# Altium project 2022_AESK_UAV.PrjPcb
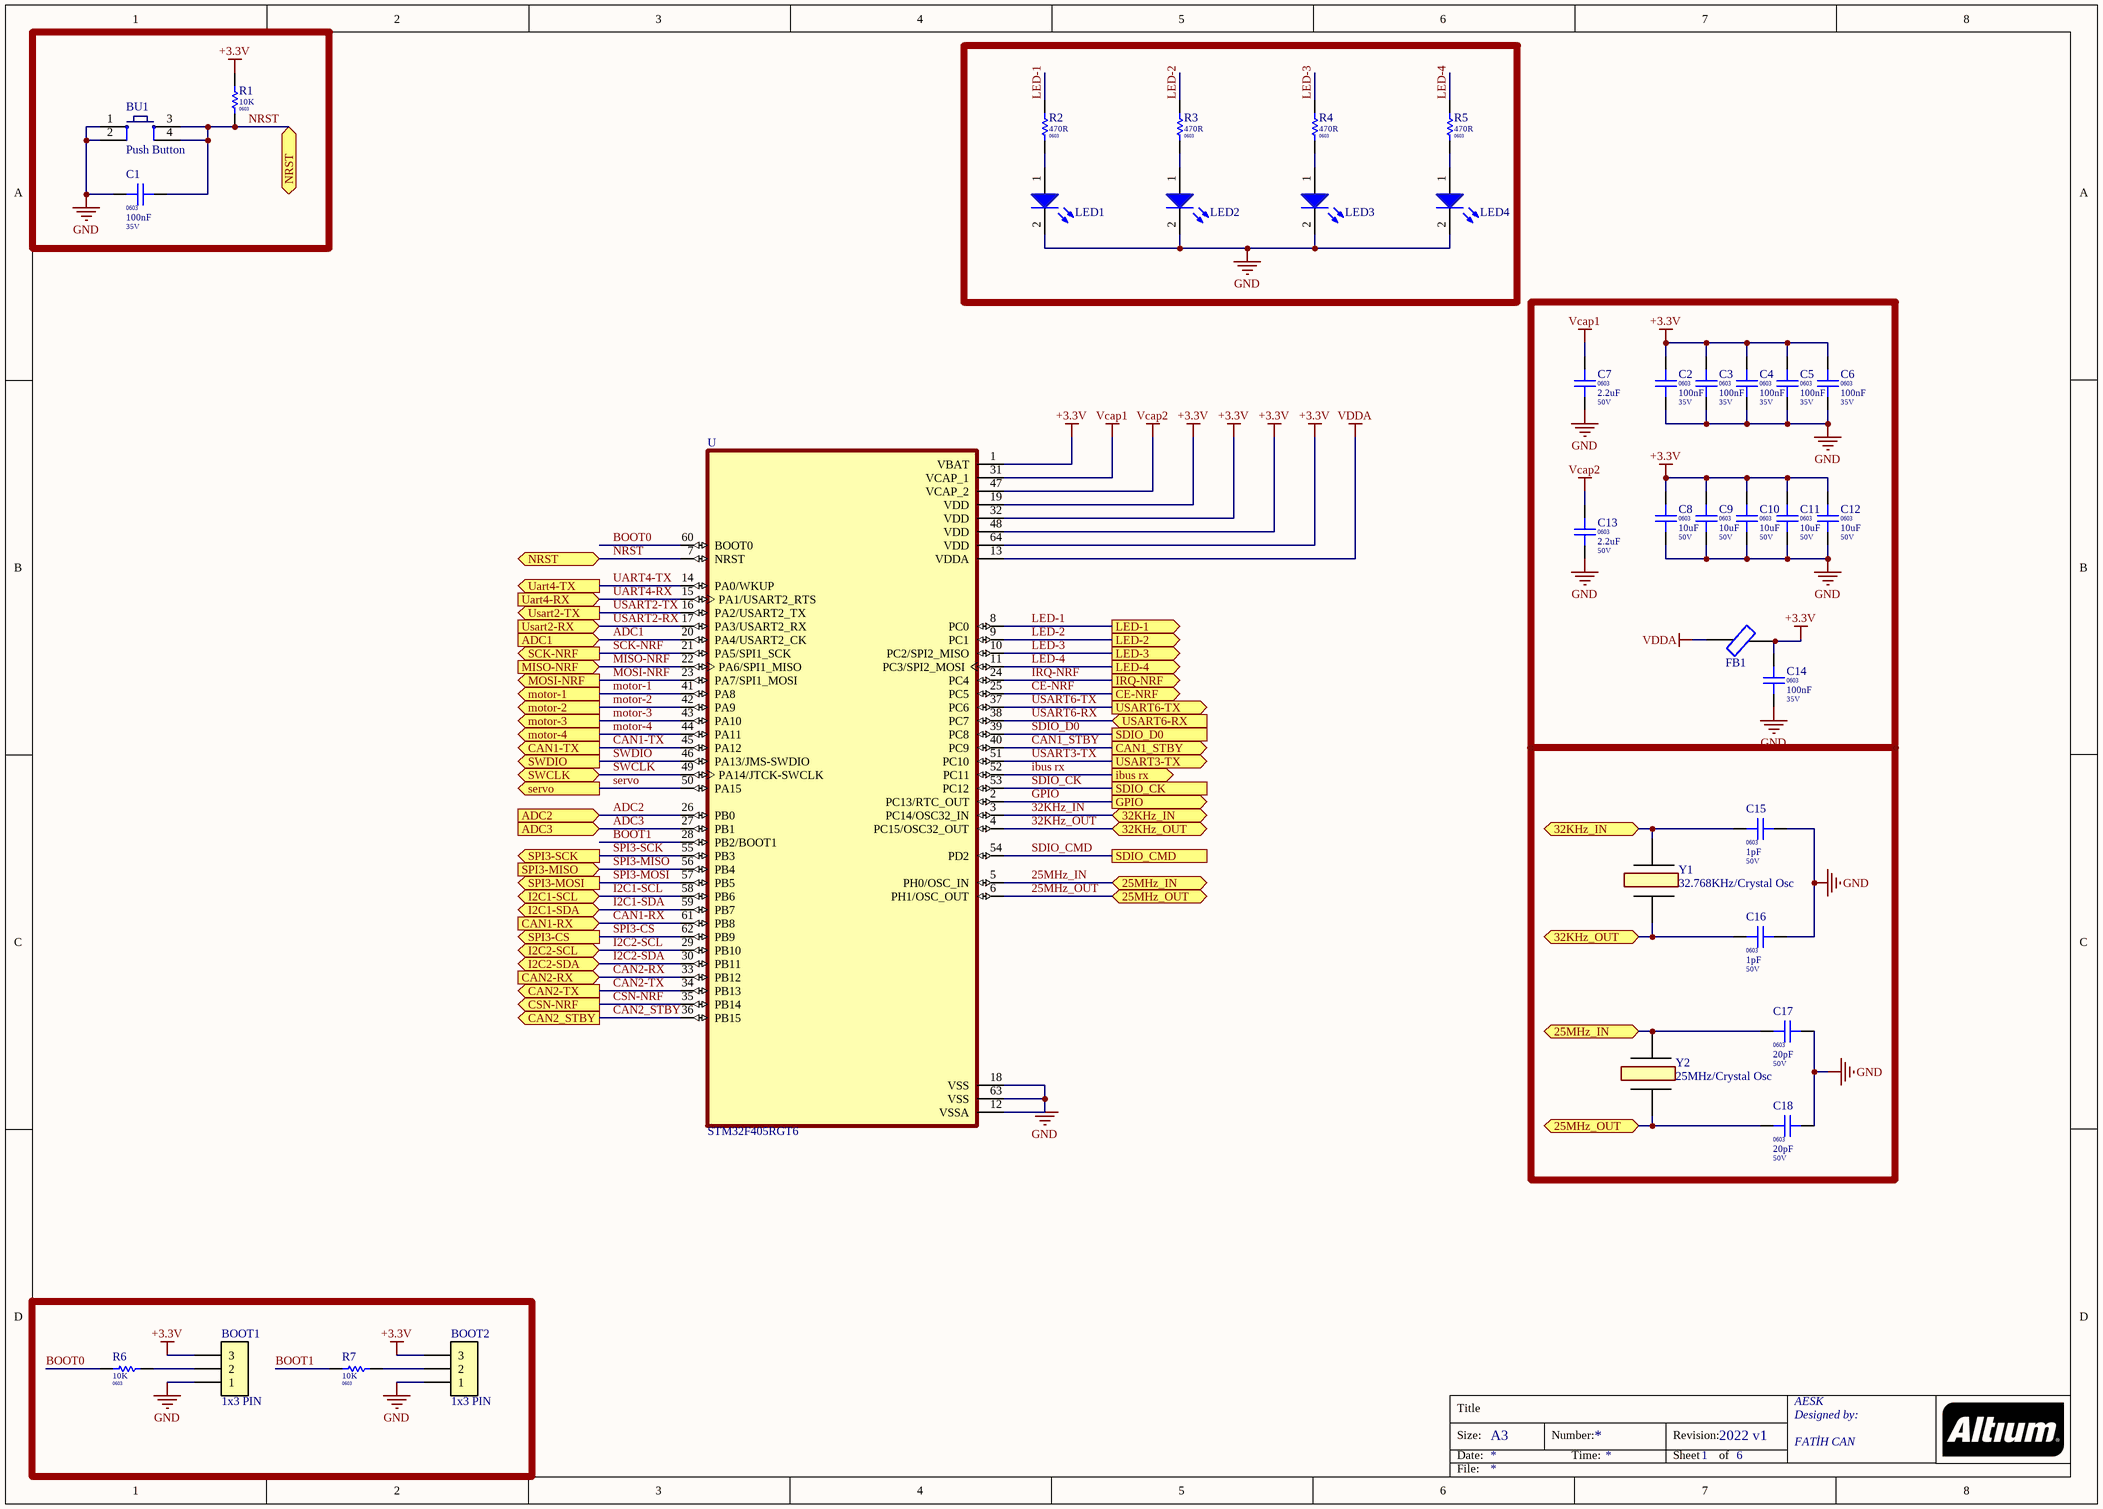
[diagram p0: 2022_AESK_UAV_Islemci.SchDoc]
6 sheets, 95 parts. Net scope: flat (ports and power ports of the same name join across sheets).
Board file: 2022_AESK_UAV.PcbDoc
Sheets:
  2022_AESK_UAV_Islemci.SchDoc
  2022_AESK_UAV_Sensors.SchDoc
  2022_AESK_UAV_Power.SchDoc
  2022_AESK_UAV_EXT_CONN.SchDoc
  2022_AESK_UAV_CAN.SchDoc
  2022_AESK_UAV_CONNECTOR.SchDoc

## Sheet 2022_AESK_UAV_Islemci.SchDoc: =ProjectName
size A3; Organization: AESK; Address1: Designed by:; Address3: FATİH CAN; Revision: 2022 v1; SheetNumber: 1; SheetTotal: 6

### Parts
BOOT1  1x3 PIN  [HDR_2.54_1X3]
BOOT2  1x3 PIN  [HDR_2.54_1X3]
BU1  Push Button  [button son]
C1  Package / Case: 0603  Voltage: 35V  [CAPC 0603]  (hidden comment: 100nF)
C2  Package / Case: 0603  Voltage: 35V  [CAPC 0603]  (hidden comment: 100nF)
C3  Package / Case: 0603  Voltage: 35V  [CAPC 0603]  (hidden comment: 100nF)
C4  Package / Case: 0603  Voltage: 35V  [CAPC 0603]  (hidden comment: 100nF)
C5  Package / Case: 0603  Voltage: 35V  [CAPC 0603]  (hidden comment: 100nF)
C6  Package / Case: 0603  Voltage: 35V  [CAPC 0603]  (hidden comment: 100nF)
C7  Package / Case: 0603  Voltage: 50V  [CAPC 0603]  (hidden comment: 2.2uF)
C8  Package / Case: 0603  Voltage: 50V  [CAPC 0603]  (hidden comment: 10uF)
C9  Package / Case: 0603  Voltage: 50V  [CAPC 0603]  (hidden comment: 10uF)
C10  Package / Case: 0603  Voltage: 50V  [CAPC 0603]  (hidden comment: 10uF)
C11  Package / Case: 0603  Voltage: 50V  [CAPC 0603]  (hidden comment: 10uF)
C12  Package / Case: 0603  Voltage: 50V  [CAPC 0603]  (hidden comment: 10uF)
C13  Package / Case: 0603  Voltage: 50V  [CAPC 0603]  (hidden comment: 2.2uF)
C14  Package / Case: 0603  Voltage: 35V  [CAPC 0603]  (hidden comment: 100nF)
C15  Package / Case: 0603  Voltage: 50V  [CAPC 0603]  (hidden comment: 1pF)
C16  Package / Case: 0603  Voltage: 50V  [CAPC 0603]  (hidden comment: 1pF)
C17  Package / Case: 0603  Voltage: 50V  [CAPC 0603]  (hidden comment: 20pF)
C18  Package / Case: 0603  Voltage: 50V  [CAPC 0603]  (hidden comment: 20pF)
FB1  Ferrite Bead  [FCM1608KF-601T03]  (value not drawn)
LED1  (no value)  [LED BLUE 0603]
LED2  (no value)  [LED BLUE 0603]
LED3  (no value)  [LED BLUE 0603]
LED4  (no value)  [LED BLUE 0603]
R1  Package / Case: 0603  [RESC 0603]  (hidden comment: 10K)
R2  Package / Case: 0603  [RESC 0603]  (hidden comment: 470R)
R3  Package / Case: 0603  [RESC 0603]  (hidden comment: 470R)
R4  Package / Case: 0603  [RESC 0603]  (hidden comment: 470R)
R5  Package / Case: 0603  [RESC 0603]  (hidden comment: 470R)
R6  Package / Case: 0603  [RESC 0603]  (hidden comment: 10K)
R7  Package / Case: 0603  [RESC 0603]  (hidden comment: 10K)
U  STM32F405RGT6  [QFP50P1200X1200X160-64N]
Y1  32.768KHz/Crystal Osc  [32KhZ crystal oscillator]
Y2  25MHz/Crystal Osc  [25MHz Crystal Oscillator]

### Ports
25MHz_IN (bidir), 25MHz_OUT (bidir), 32KHz_IN (bidir), 32KHz_OUT (bidir), ADC1 (in), ADC2 (in), ADC3 (in), CAN1-RX (in), CAN1-TX (out), CAN1_STBY (out), CAN2-RX (in), CAN2-TX (out), CAN2_STBY (out), CE-NRF (out), CSN-NRF (out), GPIO (out), I2C1-SCL (bidir), I2C1-SDA (bidir), I2C2-SCL (bidir), I2C2-SDA (bidir), ibus rx (out), IRQ-NRF (out), LED-1 (out), LED-2 (out), LED-3 (out), LED-4 (out), MISO-NRF (in), MOSI-NRF (out), motor-1 (out), motor-2 (out), motor-3 (out), motor-4 (out), NRST (bidir), SCK-NRF (out), SDIO_CK, SDIO_CMD, SDIO_D0, servo (out), SPI3-CS (out), SPI3-MISO (in), SPI3-MOSI (out), SPI3-SCK (out), SWCLK (bidir), SWDIO (out), Uart4-RX (in), Uart4-TX (out), Usart2-RX (in), Usart2-TX (out), USART3-TX (out), USART6-RX (in), USART6-TX (out)

### Nets
+3.3V: BOOT1.3 BOOT2.3 C2.2 C3.2 C4.2 C5.2 C6.2 C8.2 C9.2 C10.2 C11.2 C12.2 C14.2 FB1.2 R1.1 U.1(VBAT) U.19(VDD) U.32(VDD) U.48(VDD) U.64(VDD)
GND: BOOT1.1 BOOT2.1 BU1.1 BU1.2 C1.1 C2.1 C3.1 C4.1 C5.1 C6.1 C7.1 C8.1 C9.1 C10.1 C11.1 C12.1 C13.1 C14.1 C15.2 C16.2 C17.2 C18.2 LED1.2(C) LED2.2(C) LED3.2(C) LED4.2(C) U.12(VSSA) U.18(VSS) U.63(VSS)
Vcap1: C7.2 U.31(VCAP_1)
Vcap2: C13.2 U.47(VCAP_2)
VDDA: FB1.1 U.13(VDDA)
25MHz_IN: C17.1 U.5(PH0/OSC_IN) Y2.2 ; port 25MHz_IN
25MHz_OUT: C18.1 U.6(PH1/OSC_OUT) Y2.1 ; port 25MHz_OUT
32KHz_IN: C15.1 U.3(PC14/OSC32_IN) Y1.2 ; port 32KHz_IN
32KHz_OUT: C16.1 U.4(PC15/OSC32_OUT) Y1.1 ; port 32KHz_OUT
ADC1: U.20(PA4/USART2_CK) ; port ADC1
ADC2: U.26(PB0) ; port ADC2
ADC3: U.27(PB1) ; port ADC3
BOOT0: R6.1 U.60(BOOT0)
BOOT1: R7.1 U.28(PB2/BOOT1)
CAN1-RX: U.61(PB8) ; port CAN1-RX
CAN1-TX: U.45(PA12) ; port CAN1-TX
CAN1_STBY: U.40(PC9) ; port CAN1_STBY
CAN2-RX: U.33(PB12) ; port CAN2-RX
CAN2-TX: U.34(PB13) ; port CAN2-TX
CAN2_STBY: U.36(PB15) ; port CAN2_STBY
CE-NRF: U.25(PC5) ; port CE-NRF
CSN-NRF: U.35(PB14) ; port CSN-NRF
GPIO: U.2(PC13/RTC_OUT) ; port GPIO
I2C1-SCL: U.58(PB6) ; port I2C1-SCL
I2C1-SDA: U.59(PB7) ; port I2C1-SDA
I2C2-SCL: U.29(PB10) ; port I2C2-SCL
I2C2-SDA: U.30(PB11) ; port I2C2-SDA
ibus rx: U.52(PC11) ; port ibus rx
IRQ-NRF: U.24(PC4) ; port IRQ-NRF
LED-1: R2.2 U.8(PC0) ; port LED-1
LED-2: R3.2 U.9(PC1) ; port LED-2
LED-3: R4.2 U.10(PC2/SPI2_MISO) ; port LED-3
LED-4: R5.2 U.11(PC3/SPI2_MOSI) ; port LED-4
MISO-NRF: U.22(PA6/SPI1_MISO) ; port MISO-NRF
MOSI-NRF: U.23(PA7/SPI1_MOSI) ; port MOSI-NRF
motor-1: U.41(PA8) ; port motor-1
motor-2: U.42(PA9) ; port motor-2
motor-3: U.43(PA10) ; port motor-3
motor-4: U.44(PA11) ; port motor-4
NRST: BU1.3 BU1.4 C1.2 R1.2 U.7(NRST) ; port NRST
SCK-NRF: U.21(PA5/SPI1_SCK) ; port SCK-NRF
SDIO_CK: U.53(PC12) ; port SDIO_CK
SDIO_CMD: U.54(PD2) ; port SDIO_CMD
SDIO_D0: U.39(PC8) ; port SDIO_D0
servo: U.50(PA15) ; port servo
SPI3-CS: U.62(PB9) ; port SPI3-CS
SPI3-MISO: U.56(PB4) ; port SPI3-MISO
SPI3-MOSI: U.57(PB5) ; port SPI3-MOSI
SPI3-SCK: U.55(PB3) ; port SPI3-SCK
SWCLK: U.49(PA14/JTCK-SWCLK) ; port SWCLK
SWDIO: U.46(PA13/JMS-SWDIO) ; port SWDIO
UART4-RX: U.15(PA1/USART2_RTS) ; port Uart4-RX
UART4-TX: U.14(PA0/WKUP) ; port Uart4-TX
USART2-RX: U.17(PA3/USART2_RX) ; port Usart2-RX
USART2-TX: U.16(PA2/USART2_TX) ; port Usart2-TX
USART3-TX: U.51(PC10) ; port USART3-TX
USART6-RX: U.38(PC7) ; port USART6-RX
USART6-TX: U.37(PC6) ; port USART6-TX
NetBOOT1_2: BOOT1.2 R6.2
NetBOOT2_2: BOOT2.2 R7.2
NetLED1_1: LED1.1(A) R2.1
NetLED2_1: LED2.1(A) R3.1
NetLED3_1: LED3.1(A) R4.1
NetLED4_1: LED4.1(A) R5.1

### Notes on the sheet
- Title
- Size:
- Date:
- A3
- Number:
- Time:
- Revision:
- Sheet
- of
- File:

### Library data of the parts
BOOT1 BOOT2 = Connector0009: Header 2.54 1x3; Part Number: Connector0009; Category: Connectors; Package / Case: HDR_2.54_1X3; Values: Header 2.54 1x3
BU1 = Push Button: Smd Push Button; Satın Alma Linki: https://urun.n11.com/diger/mini-pushbutton-switch-smd-P227461537?gclid=Cj0KCQjwkoDmBRCcARIsAG3xzl8Y_-jeD7HocNM6lvuZ_rVp83568XPGtNzlPwXWLph8oCRqo0yh87UaApZYEALw_wcB&gclsrc=aw.ds
C1-C6 C14 = CAPC0328: Capacitor Ceramic 100nF 35V 0603; Tolerance: %10; Value Rating: nF; Value: 100nF; Part Number: CAPC0328; Category: Capacitor Ceramic; Values: 100nF 35V
C7 C13 = CAPC0295: Capacitor Ceramic 2.2uF 50V 0603; Tolerance: %10; Value Rating: uF; Value: 2.2uF; Part Number: CAPC0295; Category: Capacitor Ceramic; Values: 2.2uF 50V
C8-C12 = CAPC0301: Capacitor Ceramic 10uF 50V 0603; Tolerance: %10; Value Rating: uF; Value: 10uF; Part Number: CAPC0301; Category: Capacitor Ceramic; Values: 10uF 50V
C15 C16 = CAPC0233: Capacitor Ceramic 1pF 50V 0603; Tolerance: %10; Value Rating: pF; Values: 1pF 50V; Value: 1pF; Part Number: CAPC0233; Category: Capacitor Ceramic
C17 C18 = CAPC0246: Capacitor Ceramic 20pF 50V 0603; Tolerance: %10; Value Rating: pF; Value: 20pF; Part Number: CAPC0246; Category: Capacitor Ceramic; Values: 20pF 50V
FB1 = FCM1608KF-601T03
LED1-LED4 = LED BLUE: LED
R1 R6 R7 = R0220: 10K 0603; Part Number: R0220; Tolerance: %5; Power: 1/10W; Value: 10K; Category: Resistor; Values: 10K
R2-R5 = R0188: 470R 0603; Part Number: R0188; Tolerance: %5; Power: 1/10W; Value: 470R; Category: Resistor; Values: 470R
U = STM32F405RGT6: ARMÂ® CortexÂ®-M4 STM32F4 Microcontroller IC 32-Bit 168MHz 1MB _1M x 8_ FLASH 64-LQFP _10x10_; MF: STMicroelectronics; Package: LQFP-64 STMicroelectronics; Digi-Key_Purchase_URL: https://www.digikey.com/product-detail/en/stmicroelectronics/STM32F405RGT6/497-11767-ND/2754208?utm_source=snapeda&utm_medium=aggregator&utm_campaign=symbol; Value: *; MP: STM32F405RGT6; SnapEDA_Link: https://www.snapeda.com/parts/STM32F405RGT6/STMicroelectronics/view-part/105502/?ref=snap; Digi-Key_Part_Number: 497-11767-ND
Y1 = NX3215SA-32.768KHZ-EXS00A-MU00525: Crystal or Oscillator; ComponentLink1Description: New link; ComponentLink1URL: *
Y2 = ECS-250-18-5PX-F-TR: Crystal or Oscillator

## Sheet 2022_AESK_UAV_Sensors.SchDoc: =pROJECTnAME
size A4; Organization: AESK; Address1: Designed by:; Address3: FATİH CAN; Revision: 2022 v1; SheetNumber: 2; SheetTotal: 6
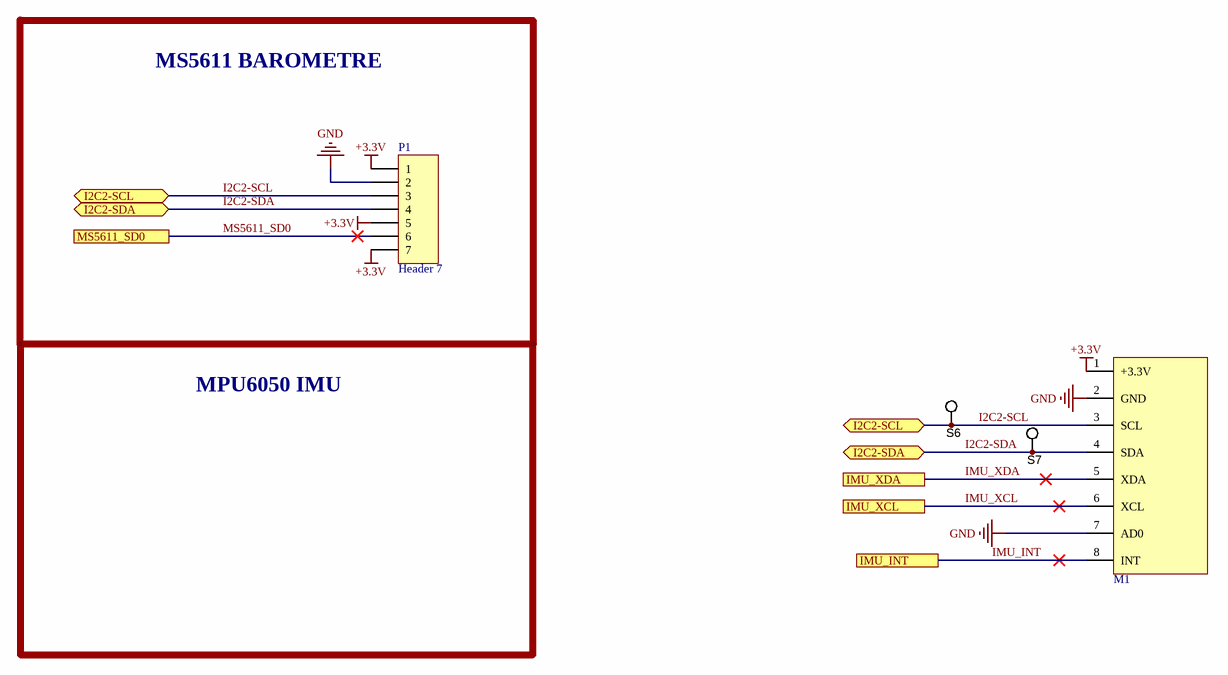
[diagram p1: 2022_AESK_UAV_Sensors.SchDoc]

### Parts
M1  MPU-9255(resim ve supplier bilgileri mpu6050dir)  [MPU-9255(GY-87)]  (value not drawn)
P1  Header 7  [HDR1X7]
S6  5002  [Keystone5002]  (value not drawn)
S7  5002  [Keystone5002]  (value not drawn)

### Ports
I2C2-SCL (bidir), I2C2-SDA (bidir), IMU_INT, IMU_XCL, IMU_XDA, MS5611_SD0

### Nets
+3.3V: M1.1(+3.3V) P1.1 P1.5 P1.7
GND: M1.2(GND) M1.7(AD0) P1.2
I2C2-SCL: M1.3(SCL) P1.3 S6.1 ; port I2C2-SCL
I2C2-SDA: M1.4(SDA) P1.4 S7.1 ; port I2C2-SDA
IMU_INT: M1.8(INT) ; port IMU_INT
IMU_XCL: M1.6(XCL) ; port IMU_XCL
IMU_XDA: M1.5(XDA) ; port IMU_XDA
MS5611_SD0: P1.6 ; port MS5611_SD0

### Notes on the sheet
- MS5611 BAROMETRE
- MPU6050 IMU
- Title
- Size:
- Date:
- A4
- Number:
- Time:
- Revision:
- Sheet
- of
- File:

### Library data of the parts
M1 = MPU-9255(GY-87): Manufacturer 1: TDK InvenSense; Manufacturer Part Number 1: MPU-6050EVB; Sensor Type: Accelerometer,Gyroscope,3 Axis; Interface: I2C; Evaluation Kit: Yes; ComponentLink1Description: MPU-9255(gyroscope/accellemeter/magnometer/barometer); ComponentLink1URL: https://pdf.direnc.net/upload/mpu-9255-datasheet.pdf; category: Sensor; Supplier 1: Digi-Key; Supplier Part Number 1: 1428-1008-ND; Stock 1: 2; Pricing 1: 1=56,00000, 5=50,75000, 10=48,12500, 25=46,55000 (USD); RoHS: Yes; Package Quantity: 1; ComponentLink2URL: https://store.invensense.com/datasheets/invensense/MPU-6000EVB.pdf?src-supplier=Digi-Key; ComponentLink2Description: https://store.invensense.com/datasheets/invensense/MPU-6000EVB.pdf?src-supplier=Digi-Key
P1 = Header 7: Header, 7-Pin; LatestRevisionDate: 17-Jul-2002; LatestRevisionNote: Re-released for DXP Platform.; Publisher: Altium Limited
S6 S7 = 5002: Test Point, TH, Miniature, White; Manufacturer: Keystone; CompType: Test Point Loop; U/M: EA; RoHS: Y; DigiKeyPartNumber: 5002K-ND; Value: White; SymbolVersion: 2008-04-04; PartNumber: 5002; PackageReference: Keystone5002; ComponentLink1Description: Datasheet Link; ComponentLink1URL: http://www.keyelco.com/pdfs/M55p51.pdf; MountType: TH; Publisher: National Semiconductor; LatestRevisionDate: 2011-09-29; LatestRevisionNote: Removed DigiKeyPartNumber parameter.; Alternate Manufacturer: -; Alternate PartNumber: -; Supplier 1: Digi-Key; Supplier Part Number 1: 5002K-ND; Supplier 2: Newark; Supplier Part Number 2: 82H9632

## Sheet 2022_AESK_UAV_Power.SchDoc: =ProjectName
size A4; Organization: AESK; Address1: Designed by:; Address3: FATİH CAN; Revision: 2022 v1; SheetNumber: 3; SheetTotal: 6; ImagePath: AMBLEM.bmp
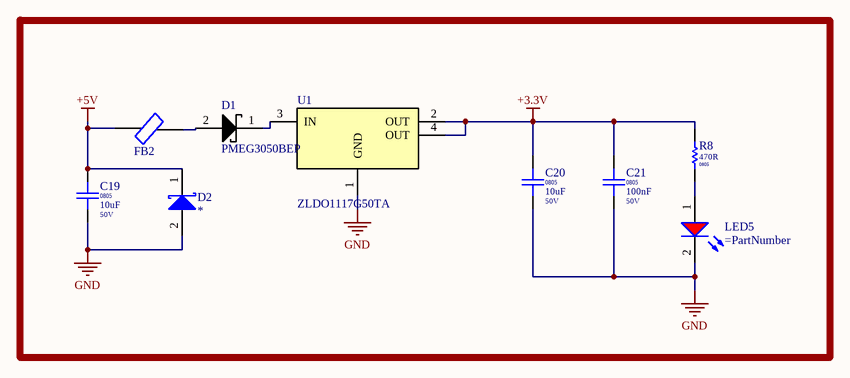
[diagram p2: 2022_AESK_UAV_Power.SchDoc]

### Parts
C19  Package / Case: 0805  Voltage: 50V  [CAPC 0805]  (hidden comment: 10uF)
C20  Package / Case: 0805  Voltage: 50V  [CAPC 0805]  (hidden comment: 10uF)
C21  Package / Case: 0805  Voltage: 50V  [CAPC 0805]  (hidden comment: 100nF)
D1  PMEG3050BEP  [SOD470X100-2N]
D2  *  [DO-214AC, SMA]
FB2  Ferrite Bead  [FCM1608KF-601T03]  (value not drawn)
LED5  (no value)  [LED RED 0805]
R8  Package / Case: 0805  [RESC 0805]  (hidden comment: 470R)
U1  ZLDO1117G50TA  [1117]

### Nets
+3.3V: C20.2 C21.2 R8.2 U1.2(OUT) U1.4(OUT)
+5V: C19.2 D2.1(K) FB2.2
GND: C19.1 C20.1 C21.1 D2.2(A) LED5.2(C) U1.1(GND)
NetD1_1: D1.1(K) U1.3(IN)
NetD1_2: D1.2(A) FB2.1
NetLED5_1: LED5.1(A) R8.1

### Notes on the sheet
- Title
- Size:
- Date:
- A4
- Number:
- Time:
- Revision:
- Sheet
- of
- File:

### Library data of the parts
C19 C20 = CAPC0588: Capacitor Ceramic 10uF 50V 0805; Value Rating: uF; Value: 10uF; Part Number: CAPC0588; Category: Capacitor Ceramic; Values: 10uF 50V
C21 = CAPC0572: Capacitor Ceramic 100nF 50V 0805; Value Rating: nF; Favorites: Favorite; Value: 100nF; Part Number: CAPC0572; Category: Capacitor Ceramic; Values: 100nF 50V
D1 = Schotky Diode: Manufacturer: Nexperia USA; Manufacturer Part Number: PMEG3050BEP,115; Supplier 1: Digi-Key; Supplier Part Number 1: 1727-5207-1-ND; Stock 1: 62590; Pricing 1: 1=0.44, 10=0.373, 100=0.2786, 500=0.2189, 1000=0.1692 (USD)
D2 = Diode0012: Values: FILL!!!; Diode Type: Schottky; Manufacturer Part Number: *; Part Number: Diode0012; Category: Diode Schottky; Package / Case: DO-214AC, SMA; Voltage - DC Reverse (Vr): FILL!!!; Voltage - Forward (Vf): FILL!!!; Current: FILL!!!; Speed: FILL!!!
FB2 = FCM1608KF-601T03
LED5 = LED RED: LED
R8 = R0334: 470R 0805; Part Number: R0334; Value: 470R; Category: Resistor; Values: 470R
U1 = ZLDO1117G50TA: IC REG LDO 5V 1A SOT223

## Sheet 2022_AESK_UAV_EXT_CONN.SchDoc: =ProjectNAME
size A4; Author: Fatih; Organization: AESK; Address1: Designed by:; Address3: FATİH CAN; SheetNumber: 4; SheetTotal: 6
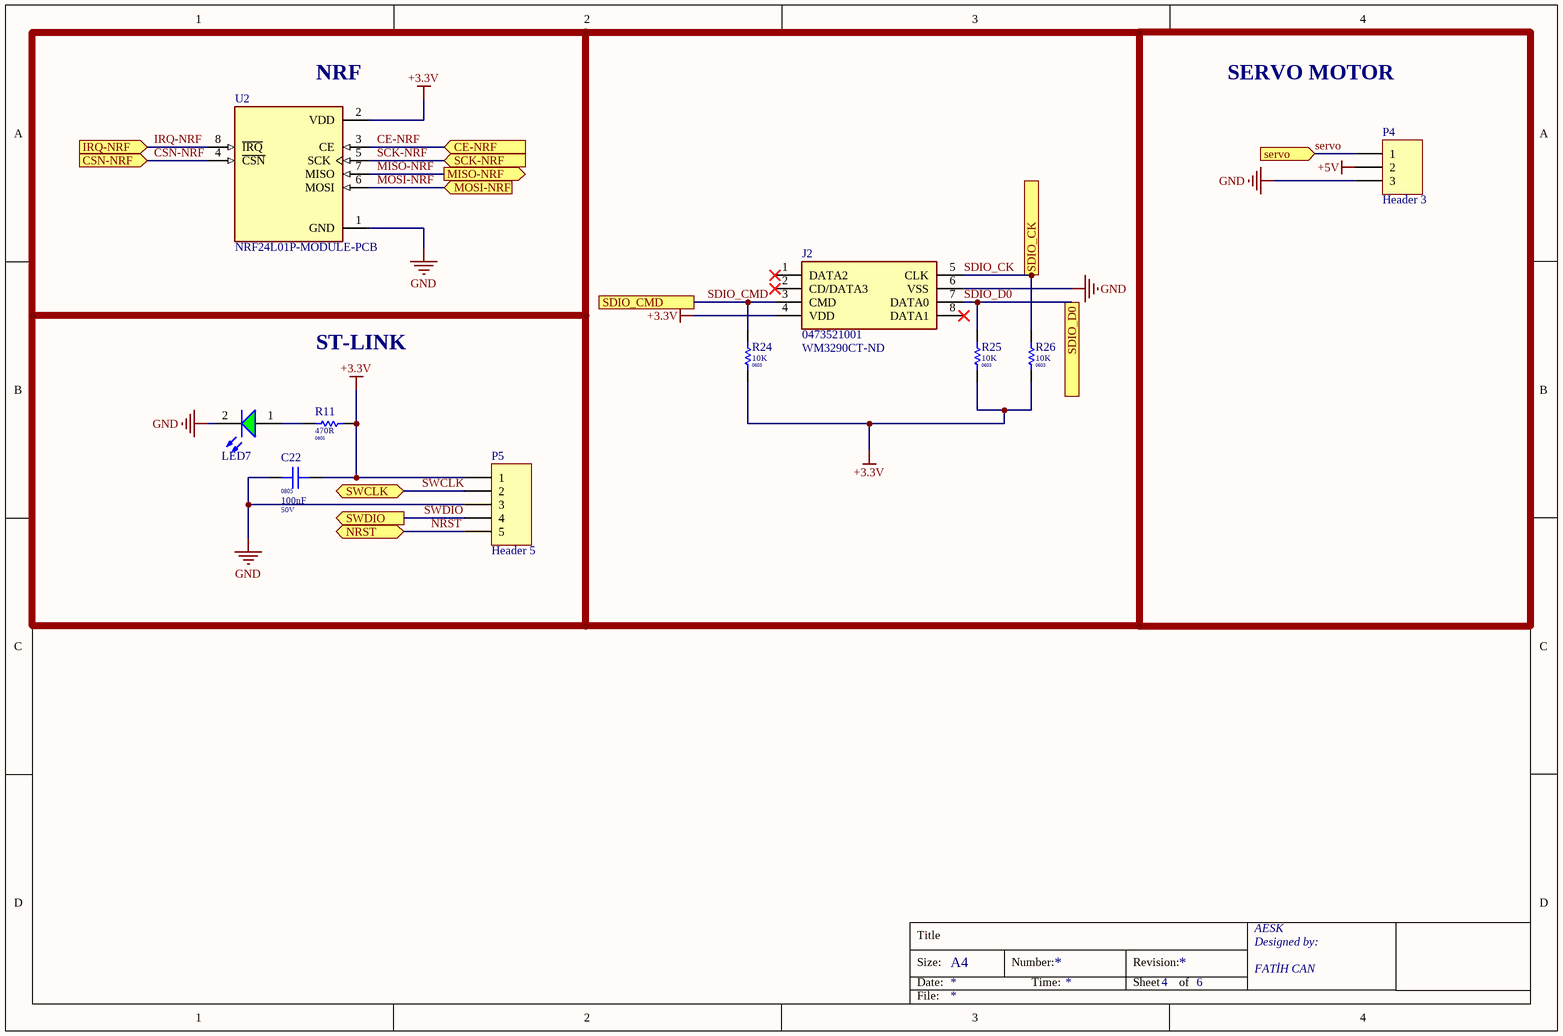
[diagram p3: 2022_AESK_UAV_EXT_CONN.SchDoc]

### Parts
C22  Package / Case: 0805  Voltage: 50V  [CAPC 0805]  (hidden comment: 100nF)
J2  0473521001  Supplier Part Number 1: WM3290CT-ND  [47352-1001]
LED7  (no value)  [LED GREEN 0805]
P4  Header 3  [HDR1X3]
P5  Header 5  [HDR1X5]
R11  Package / Case: 0805  [RESC 0805]  (hidden comment: 470R)
R24  Package / Case: 0603  [RESC 0603]  (hidden comment: 10K)
R25  Package / Case: 0603  [RESC 0603]  (hidden comment: 10K)
R26  Package / Case: 0603  [RESC 0603]  (hidden comment: 10K)
U2  NRF24L01P-MODULE-PCB  [nrf]

### Ports
CE-NRF (in), CSN-NRF (in), IRQ-NRF (in), MISO-NRF (out), MOSI-NRF (in), NRST (bidir), SCK-NRF (in), SDIO_CK, SDIO_CMD, SDIO_D0, servo (in), SWCLK (bidir), SWDIO (out)

### Nets
+3.3V: C22.2 J2.4(VDD) P5.1 R11.2 R24.1 R25.1 R26.1 U2.2(VDD)
+5V: P4.2
GND: C22.1 J2.6(VSS) LED7.2(C) P4.3 P5.3 U2.1(GND)
CE-NRF: U2.3(CE) ; port CE-NRF
CSN-NRF: U2.4(~{CSN}) ; port CSN-NRF
IRQ-NRF: U2.8(~{IRQ}) ; port IRQ-NRF
MISO-NRF: U2.7(MISO) ; port MISO-NRF
MOSI-NRF: U2.6(MOSI) ; port MOSI-NRF
NRST: P5.5 ; port NRST
SCK-NRF: U2.5(SCK) ; port SCK-NRF
SDIO_CK: J2.5(CLK) R26.2 ; port SDIO_CK
SDIO_CMD: J2.3(CMD) R24.2 ; port SDIO_CMD
SDIO_D0: J2.7(DATA0) R25.2 ; port SDIO_D0
servo: P4.1 ; port servo
SWCLK: P5.2 ; port SWCLK
SWDIO: P5.4 ; port SWDIO
NetLED7_1: LED7.1(A) R11.1

Not connected (* = marked no-connect by the designer): J2 1(DATA2)* 2(CD/DATA3)* 8(DATA1)*

### Notes on the sheet
- (near U2) NRF
- SERVO MOTOR
- ST-LINK
- Title
- Size:
- Date:
- A4
- Number:
- Time:
- Revision:
- Sheet
- of
- File:

### Library data of the parts
C22 = CAPC0572: Capacitor Ceramic 100nF 50V 0805; Tolerance: %10; Value Rating: nF; Favorites: Favorite; Value: 100nF; Part Number: CAPC0572; Category: Capacitor Ceramic; Values: 100nF 50V
J2 = 0473521001: microSD Card Module; Manufacturer_Name: Molex; Datasheet Link: https://www.molex.com/pdm_docs/sd/473521001_sd.pdf; Manufacturer_Part_Number: 0473521001; Supplier 1: Digi-Key
LED7 = LED GREEN: LED
P4 = Header 3: Header, 3-Pin; LatestRevisionDate: 17-Jul-2002; LatestRevisionNote: Re-released for DXP Platform.; Publisher: Altium Limited
P5 = Header 5: Header, 5-Pin; LatestRevisionDate: 17-Jul-2002; LatestRevisionNote: Re-released for DXP Platform.; Publisher: Altium Limited
R11 = R0334: 470R 0805; Part Number: R0334; Tolerance: %5; Power: 1/10W; Value: 470R; Category: Resistor; Values: 470R
R24-R26 = R0220: as R1 on sheet 2022_AESK_UAV_Islemci; Value: 10K; Category: Resistor; Values: 10K
U2 = NRF24L01P-MODULE-PCB: - Transceiver For Use With nRF24L01+; MF: Nordic Semiconductor; Package: None; MP: NRF24L01P-MODULE-PCB; Value: *; Availability: Bad; Price: None; SnapEDA_Link: https://www.snapeda.com/parts/NRF24L01P-MODULE-PCB/Nordic%20Semiconductor%20ASA/view-part/230534/?ref=snap; Mouser-Purchase-URL: https://snapeda.com/shop?store=Mouser&id=230534

## Sheet 2022_AESK_UAV_CAN.SchDoc
size A4
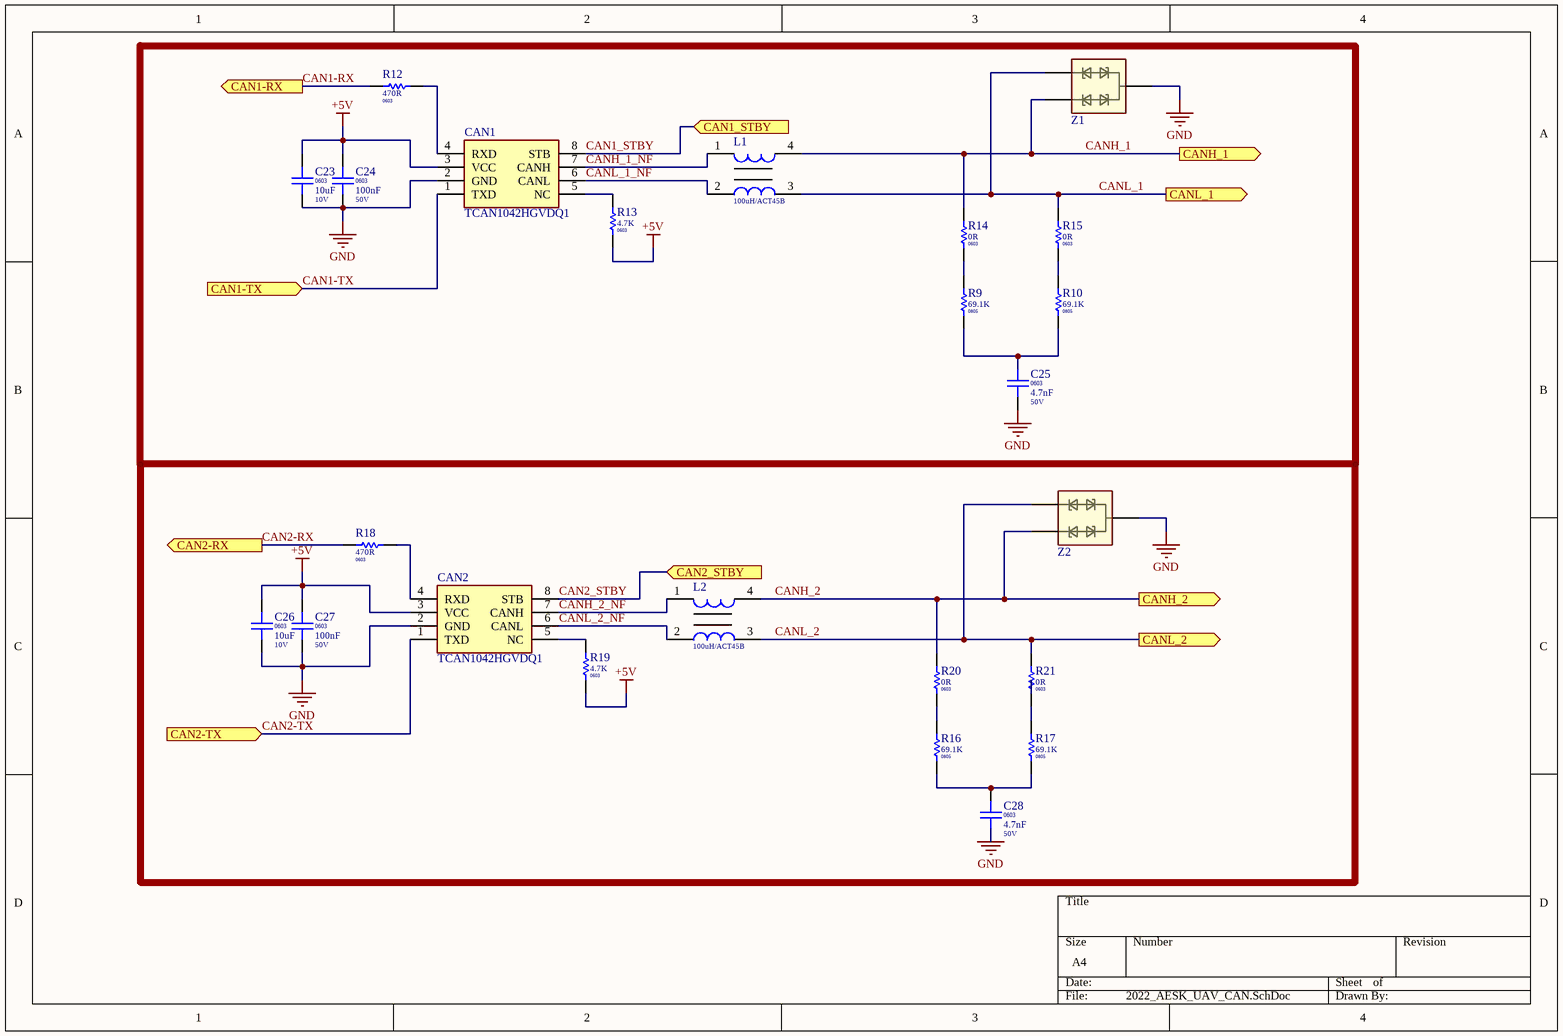
[diagram p4: 2022_AESK_UAV_CAN.SchDoc]

### Parts
C23  Package / Case: 0603  Voltage: 10V  [CAPC 0603]  (hidden comment: 10uF)
C24  Package / Case: 0603  Voltage: 50V  [CAPC 0603]  (hidden comment: 100nF)
C25  Package / Case: 0603  Voltage: 50V  [CAPC 0603]  (hidden comment: 4.7nF)
C26  Package / Case: 0603  Voltage: 10V  [CAPC 0603]  (hidden comment: 10uF)
C27  Package / Case: 0603  Voltage: 50V  [CAPC 0603]  (hidden comment: 100nF)
C28  Package / Case: 0603  Voltage: 50V  [CAPC 0603]  (hidden comment: 4.7nF)
CAN1  TCAN1042HGVDQ1  [SOIC127P600X175-8N]
CAN2  TCAN1042HGVDQ1  [SOIC127P600X175-8N]
L1  Name: 100uH/ACT45B  [TDK_ACT45B_2]  (hidden comment: ACT45B-101-2P-TL003)
L2  Name: 100uH/ACT45B  [TDK_ACT45B_2]  (hidden comment: ACT45B-101-2P-TL003)
R9  Package / Case: 0805  [RESC 0805]  (hidden comment: 69.1K)
R10  Package / Case: 0805  [RESC 0805]  (hidden comment: 69.1K)
R12  Package / Case: 0603  [RESC 0603]  (hidden comment: 470R)
R13  Package / Case: 0603  [RESC 0603]  (hidden comment: 4.7K)
R14  Package / Case: 0603  [RESC 0603]  (hidden comment: 0R)
R15  Package / Case: 0603  [RESC 0603]  (hidden comment: 0R)
R16  Package / Case: 0805  [RESC 0805]  (hidden comment: 69.1K)
R17  Package / Case: 0805  [RESC 0805]  (hidden comment: 69.1K)
R18  Package / Case: 0603  [RESC 0603]  (hidden comment: 470R)
R19  Package / Case: 0603  [RESC 0603]  (hidden comment: 4.7K)
R20  Package / Case: 0603  [RESC 0603]  (hidden comment: 0R)
R21  Package / Case: 0603  [RESC 0603]  (hidden comment: 0R)
Z1  PESD2CAN,215  [SOT95P230X110-3N]  (value not drawn)
Z2  PESD2CAN,215  [SOT95P230X110-3N]  (value not drawn)

### Ports
CAN1-RX (out), CAN1-TX (in), CAN1_STBY (in), CAN2-RX (out), CAN2-TX (in), CAN2_STBY (in), CANH_1 (out), CANH_2 (out), CANL_1 (out), CANL_2 (out)

### Nets
+5V: C23.2 C24.2 C26.2 C27.2 CAN1.3(VCC) CAN2.3(VCC) R13.1 R19.1
GND: C23.1 C24.1 C25.1 C26.1 C27.1 C28.2 CAN1.2(GND) CAN2.2(GND) Z1.3 Z2.3
CAN1-RX: R12.1 ; port CAN1-RX
CAN1-TX: CAN1.1(TXD) ; port CAN1-TX
CAN1_STBY: CAN1.8(STB) ; port CAN1_STBY
CAN2-RX: R18.1 ; port CAN2-RX
CAN2-TX: CAN2.1(TXD) ; port CAN2-TX
CAN2_STBY: CAN2.8(STB) ; port CAN2_STBY
CANH_1: L1.4 R14.2 Z1.2 ; port CANH_1
CANH_1_NF: CAN1.7(CANH) L1.1
CANH_2: L2.4 R20.2 Z2.2 ; port CANH_2
CANH_2_NF: CAN2.7(CANH) L2.1
CANL_1: L1.3 R15.2 Z1.1 ; port CANL_1
CANL_1_NF: CAN1.6(CANL) L1.2
CANL_2: L2.3 R21.2 Z2.1 ; port CANL_2
CANL_2_NF: CAN2.6(CANL) L2.2
NetC25_2: C25.2 R9.1 R10.1
NetC28_1: C28.1 R16.1 R17.1
NetCAN1_4: CAN1.4(RXD) R12.2
NetCAN1_5: CAN1.5(NC) R13.2
NetCAN2_4: CAN2.4(RXD) R18.2
NetCAN2_5: CAN2.5(NC) R19.2
NetR9_2: R9.2 R14.1
NetR10_2: R10.2 R15.1
NetR16_2: R16.2 R20.1
NetR17_2: R17.2 R21.1

### Library data of the parts
C23 C26 = CAPC0473: Capacitor Ceramic 10uF 10V 0603; Tolerance: %10; Value Rating: uF; Favorites: Favorite; Value: 10uF; Part Number: CAPC0473; Category: Capacitor Ceramic; Values: 10uF 10V
C24 C27 = CAPC0285: Capacitor Ceramic 100nF 50V 0603; Tolerance: %10; Value Rating: nF; Favorites: Favorite; Value: 100nF; Part Number: CAPC0285; Category: Capacitor Ceramic; Values: 100nF 50V
C25 C28 = CAPC0273: Capacitor Ceramic 4.7nF 50V 0603; Tolerance: %10; Value Rating: nF; Value: 4.7nF; Part Number: CAPC0273; Category: Capacitor Ceramic; Values: 4.7nF 50V
CAN1 CAN2 = TCAN1042HGVDQ1: Integrated Circuit; Manufacturer_Name: Texas Instruments; Manufacturer_Part_Number: TCAN1042HDRQ1; Datasheet Link: http://www.ti.com/lit/gpn/tcan1042hgv-q1; Height: 1.75mm; Mouser Part Number: 595-TCAN1042HGVDQ1; Mouser Price/Stock: https://www.mouser.com/Search/Refine.aspx?Keyword=595-TCAN1042HGVDQ1; RS Part Number: 1330710P; RS Price/Stock: http://uk.rs-online.com/web/p/products/1330710P; Supplier 1: Digi-Key; Supplier Part Number 1: 296-47722-ND
L1 L2 = ACT45B-101-2P-TL003: Inductor; Manufacturer Name: TDK; Datasheet Link: https://product.tdk.com/info/en/catalog/datasheets/cmf_automotive_signal_act45b_en.pdf; Mouser Price/Stock: https://www.mouser.com/Search/Refine.aspx?Keyword=810-ACT45B1012PTL003
R9 R16 R17 = R0386: 68K 0805; Part Number: R0386; Tolerance: %5; Power: 1/10W; Value: 69.1K; Category: Resistor; Values: 68K
R10 = R0386: 69.1K 0805; Part Number: R0386; Tolerance: %5; Power: 1/10W; Values: 68K; Value: 69.1K; Category: Resistor
R12 R18 = R0188: as R2 on sheet 2022_AESK_UAV_Islemci; Value: 470R; Category: Resistor; Values: 470R
R13 R19 = R0212: 4.7K 0603; Part Number: R0212; Tolerance: %5; Power: 1/10W; Value: 4.7K; Category: Resistor; Values: 4.7K
R14 R15 R20 R21 = R0148: 0R 0603; Part Number: R0148; Tolerance: %5; Power: 1/10W; Value: 0R; Category: Resistor; Values: 0R
Z1 Z2 = PESD2CAN,215: Zener Diode; Manufacturer_Name: Nexperia; Datasheet Link: http://de.rs-online.com/webdocs/0b4d/0900766b80b4dbb6.pdf; Height: 1.1mm; Manufacturer_Part_Number: PESD2CAN,215; Mouser Part Number: 771-PESD2CAN-T/R; Mouser Price/Stock: https://www.mouser.com/Search/Refine.aspx?Keyword=771-PESD2CAN-T%2FR; RS Part Number: 0508462; RS Price/Stock: http://uk.rs-online.com/web/p/products/0508462

## Sheet 2022_AESK_UAV_CONNECTOR.SchDoc
size A4; Organization: AESK; Address1: Designer by:; Address3: FATİH CAN; SheetNumber: 6; SheetTotal: 6
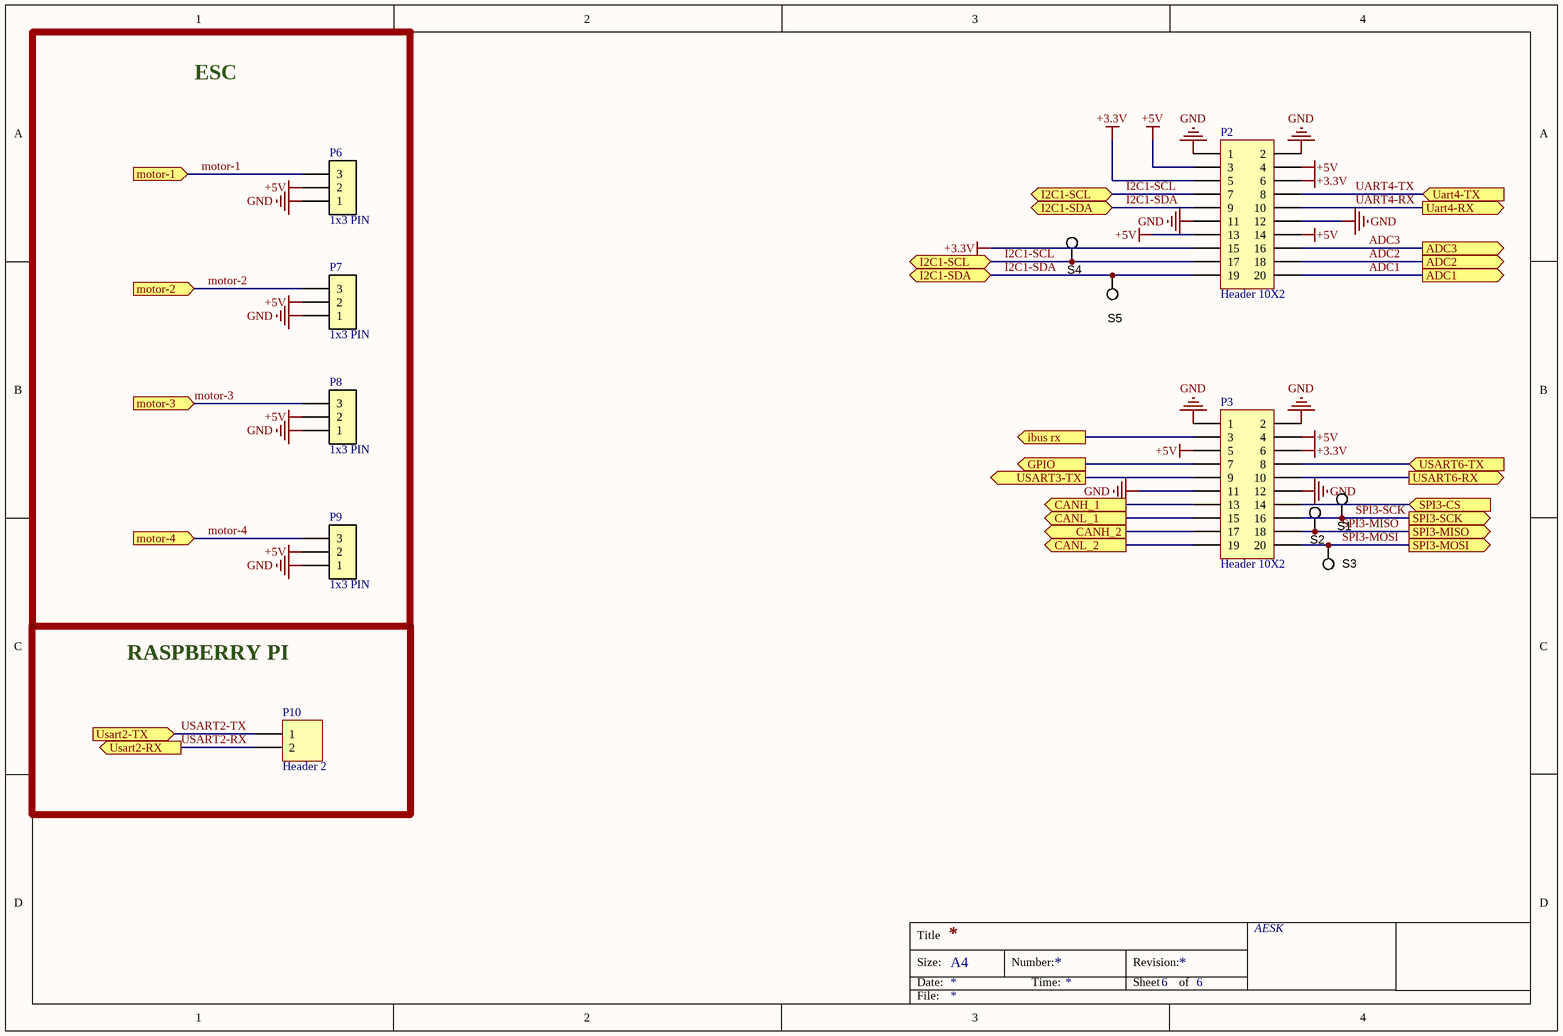
[diagram p5: 2022_AESK_UAV_CONNECTOR.SchDoc]

### Parts
P2  Header 10X2  [HDR2X10]
P3  Header 10X2  [HDR2X10]
P6  1x3 PIN  [HDR_2.54_1X3]
P7  1x3 PIN  [HDR_2.54_1X3]
P8  1x3 PIN  [HDR_2.54_1X3]
P9  1x3 PIN  [HDR_2.54_1X3]
P10  Header 2  [HDR1X2]
S1  5002  [Keystone5002]  (value not drawn)
S2  5002  [Keystone5002]  (value not drawn)
S3  5002  [Keystone5002]  (value not drawn)
S4  5002  [Keystone5002]  (value not drawn)
S5  5002  [Keystone5002]  (value not drawn)

### Ports
ADC1 (out), ADC2 (out), ADC3 (out), CANH_1 (out), CANH_2 (out), CANL_1 (out), CANL_2 (out), GPIO (out), I2C1-SCL (bidir), I2C1-SDA (bidir), ibus rx (out), motor-1 (in), motor-2 (in), motor-3 (in), motor-4 (in), SPI3-CS (in), SPI3-MISO (out), SPI3-MOSI (out), SPI3-SCK (out), Uart4-RX (out), Uart4-TX (in), Usart2-RX (out), Usart2-TX (in), USART3-TX (out), USART6-RX (out), USART6-TX (in)

### Nets
+3.3V: P2.5 P2.6 P2.15 P3.6
+5V: P2.3 P2.4 P2.13 P2.14 P3.4 P3.5 P6.2 P7.2 P8.2 P9.2
GND: P2.1 P2.2 P2.11 P2.12 P3.1 P3.2 P3.11 P3.12 P6.1 P7.1 P8.1 P9.1
ADC1: P2.20 ; port ADC1
ADC2: P2.18 ; port ADC2
ADC3: P2.16 ; port ADC3
CANH_1: P3.13 ; port CANH_1
CANH_2: P3.17 ; port CANH_2
CANL_1: P3.15 ; port CANL_1
CANL_2: P3.19 ; port CANL_2
GPIO: P3.7 ; port GPIO
I2C1-SCL: P2.7 P2.17 S4.1 ; port I2C1-SCL
I2C1-SDA: P2.9 P2.19 S5.1 ; port I2C1-SDA
ibus rx: P3.3 ; port ibus rx
motor-1: P6.3 ; port motor-1
motor-2: P7.3 ; port motor-2
motor-3: P8.3 ; port motor-3
motor-4: P9.3 ; port motor-4
SPI3-CS: P3.14 ; port SPI3-CS
SPI3-MISO: P3.18 S2.1 ; port SPI3-MISO
SPI3-MOSI: P3.20 S3.1 ; port SPI3-MOSI
SPI3-SCK: P3.16 S1.1 ; port SPI3-SCK
UART4-RX: P2.10 ; port Uart4-RX
UART4-TX: P2.8 ; port Uart4-TX
USART2-RX: P10.2 ; port Usart2-RX
USART2-TX: P10.1 ; port Usart2-TX
USART3-TX: P3.9 ; port USART3-TX
USART6-RX: P3.10 ; port USART6-RX
USART6-TX: P3.8 ; port USART6-TX

### Notes on the sheet
- ESC
- RASPBERRY PI
- Title
- Size:
- Date:
- A4
- Number:
- Time:
- Revision:
- Sheet
- of
- File:

### Library data of the parts
P2 P3 = Header 10X2: Header, 10-Pin, Dual row; LatestRevisionDate: 17-Jul-2002; LatestRevisionNote: Re-released for DXP Platform.; Publisher: Altium Limited
P6-P9 = Connector0009: Header 2.54 1x3; Part Number: Connector0009; Category: Connectors; Package / Case: HDR_2.54_1X3; Values: Header 2.54 1x3
P10 = Header 2: Header, 2-Pin; LatestRevisionDate: 17-Jul-2002; LatestRevisionNote: Re-released for DXP Platform.; Publisher: Altium Limited
S1-S5 = 5002: as S6 on sheet 2022_AESK_UAV_Sensors; RoHS: Y; DigiKeyPartNumber: 5002K-ND; Value: White; SymbolVersion: 2008-04-04; PartNumber: 5002; PackageReference: Keystone5002; ComponentLink1Description: Datasheet Link; ComponentLink1URL: http://www.keyelco.com/pdfs/M55p51.pdf; MountType: TH; Publisher: National Semiconductor; LatestRevisionDate: 2011-09-29; LatestRevisionNote: Removed DigiKeyPartNumber parameter.; Alternate Manufacturer: -; Alternate PartNumber: -; Supplier 1: Digi-Key; Supplier Part Number 1: 5002K-ND; Supplier 2: Newark; Supplier Part Number 2: 82H9632

## Nets that join several sheets
+3.3V: 2022_AESK_UAV_Islemci (20 pins), 2022_AESK_UAV_Sensors (M1.1 P1.1 P1.5 P1.7), 2022_AESK_UAV_Power (5 pins), 2022_AESK_UAV_EXT_CONN (8 pins), 2022_AESK_UAV_CONNECTOR (P2.5 P2.6 P2.15 P3.6)
+5V: 2022_AESK_UAV_Power (C19.2 D2.1 FB2.2), 2022_AESK_UAV_EXT_CONN (P4.2), 2022_AESK_UAV_CAN (8 pins), 2022_AESK_UAV_CONNECTOR (10 pins)
GND: 2022_AESK_UAV_Islemci (29 pins), 2022_AESK_UAV_Sensors (M1.2 M1.7 P1.2), 2022_AESK_UAV_Power (6 pins), 2022_AESK_UAV_EXT_CONN (6 pins), 2022_AESK_UAV_CAN (10 pins), 2022_AESK_UAV_CONNECTOR (12 pins)
ADC1: 2022_AESK_UAV_Islemci (U.20), 2022_AESK_UAV_CONNECTOR (P2.20)
ADC2: 2022_AESK_UAV_Islemci (U.26), 2022_AESK_UAV_CONNECTOR (P2.18)
ADC3: 2022_AESK_UAV_Islemci (U.27), 2022_AESK_UAV_CONNECTOR (P2.16)
CAN1-RX: 2022_AESK_UAV_Islemci (U.61), 2022_AESK_UAV_CAN (R12.1)
CAN1-TX: 2022_AESK_UAV_Islemci (U.45), 2022_AESK_UAV_CAN (CAN1.1)
CAN1_STBY: 2022_AESK_UAV_Islemci (U.40), 2022_AESK_UAV_CAN (CAN1.8)
CAN2-RX: 2022_AESK_UAV_Islemci (U.33), 2022_AESK_UAV_CAN (R18.1)
CAN2-TX: 2022_AESK_UAV_Islemci (U.34), 2022_AESK_UAV_CAN (CAN2.1)
CAN2_STBY: 2022_AESK_UAV_Islemci (U.36), 2022_AESK_UAV_CAN (CAN2.8)
CANH_1: 2022_AESK_UAV_CAN (L1.4 R14.2 Z1.2), 2022_AESK_UAV_CONNECTOR (P3.13)
CANH_2: 2022_AESK_UAV_CAN (L2.4 R20.2 Z2.2), 2022_AESK_UAV_CONNECTOR (P3.17)
CANL_1: 2022_AESK_UAV_CAN (L1.3 R15.2 Z1.1), 2022_AESK_UAV_CONNECTOR (P3.15)
CANL_2: 2022_AESK_UAV_CAN (L2.3 R21.2 Z2.1), 2022_AESK_UAV_CONNECTOR (P3.19)
CE-NRF: 2022_AESK_UAV_Islemci (U.25), 2022_AESK_UAV_EXT_CONN (U2.3)
CSN-NRF: 2022_AESK_UAV_Islemci (U.35), 2022_AESK_UAV_EXT_CONN (U2.4)
GPIO: 2022_AESK_UAV_Islemci (U.2), 2022_AESK_UAV_CONNECTOR (P3.7)
I2C1-SCL: 2022_AESK_UAV_Islemci (U.58), 2022_AESK_UAV_CONNECTOR (P2.7 P2.17 S4.1)
I2C1-SDA: 2022_AESK_UAV_Islemci (U.59), 2022_AESK_UAV_CONNECTOR (P2.9 P2.19 S5.1)
I2C2-SCL: 2022_AESK_UAV_Islemci (U.29), 2022_AESK_UAV_Sensors (M1.3 P1.3 S6.1)
I2C2-SDA: 2022_AESK_UAV_Islemci (U.30), 2022_AESK_UAV_Sensors (M1.4 P1.4 S7.1)
ibus rx: 2022_AESK_UAV_Islemci (U.52), 2022_AESK_UAV_CONNECTOR (P3.3)
IRQ-NRF: 2022_AESK_UAV_Islemci (U.24), 2022_AESK_UAV_EXT_CONN (U2.8)
MISO-NRF: 2022_AESK_UAV_Islemci (U.22), 2022_AESK_UAV_EXT_CONN (U2.7)
MOSI-NRF: 2022_AESK_UAV_Islemci (U.23), 2022_AESK_UAV_EXT_CONN (U2.6)
motor-1: 2022_AESK_UAV_Islemci (U.41), 2022_AESK_UAV_CONNECTOR (P6.3)
motor-2: 2022_AESK_UAV_Islemci (U.42), 2022_AESK_UAV_CONNECTOR (P7.3)
motor-3: 2022_AESK_UAV_Islemci (U.43), 2022_AESK_UAV_CONNECTOR (P8.3)
motor-4: 2022_AESK_UAV_Islemci (U.44), 2022_AESK_UAV_CONNECTOR (P9.3)
NRST: 2022_AESK_UAV_Islemci (5 pins), 2022_AESK_UAV_EXT_CONN (P5.5)
SCK-NRF: 2022_AESK_UAV_Islemci (U.21), 2022_AESK_UAV_EXT_CONN (U2.5)
SDIO_CK: 2022_AESK_UAV_Islemci (U.53), 2022_AESK_UAV_EXT_CONN (J2.5 R26.2)
SDIO_CMD: 2022_AESK_UAV_Islemci (U.54), 2022_AESK_UAV_EXT_CONN (J2.3 R24.2)
SDIO_D0: 2022_AESK_UAV_Islemci (U.39), 2022_AESK_UAV_EXT_CONN (J2.7 R25.2)
servo: 2022_AESK_UAV_Islemci (U.50), 2022_AESK_UAV_EXT_CONN (P4.1)
SPI3-CS: 2022_AESK_UAV_Islemci (U.62), 2022_AESK_UAV_CONNECTOR (P3.14)
SPI3-MISO: 2022_AESK_UAV_Islemci (U.56), 2022_AESK_UAV_CONNECTOR (P3.18 S2.1)
SPI3-MOSI: 2022_AESK_UAV_Islemci (U.57), 2022_AESK_UAV_CONNECTOR (P3.20 S3.1)
SPI3-SCK: 2022_AESK_UAV_Islemci (U.55), 2022_AESK_UAV_CONNECTOR (P3.16 S1.1)
SWCLK: 2022_AESK_UAV_Islemci (U.49), 2022_AESK_UAV_EXT_CONN (P5.2)
SWDIO: 2022_AESK_UAV_Islemci (U.46), 2022_AESK_UAV_EXT_CONN (P5.4)
UART4-RX: 2022_AESK_UAV_Islemci (U.15), 2022_AESK_UAV_CONNECTOR (P2.10)
UART4-TX: 2022_AESK_UAV_Islemci (U.14), 2022_AESK_UAV_CONNECTOR (P2.8)
USART2-RX: 2022_AESK_UAV_Islemci (U.17), 2022_AESK_UAV_CONNECTOR (P10.2)
USART2-TX: 2022_AESK_UAV_Islemci (U.16), 2022_AESK_UAV_CONNECTOR (P10.1)
USART3-TX: 2022_AESK_UAV_Islemci (U.51), 2022_AESK_UAV_CONNECTOR (P3.9)
USART6-RX: 2022_AESK_UAV_Islemci (U.38), 2022_AESK_UAV_CONNECTOR (P3.10)
USART6-TX: 2022_AESK_UAV_Islemci (U.37), 2022_AESK_UAV_CONNECTOR (P3.8)